# Altium schematic sheet QTouch2.SchDoc
size A4
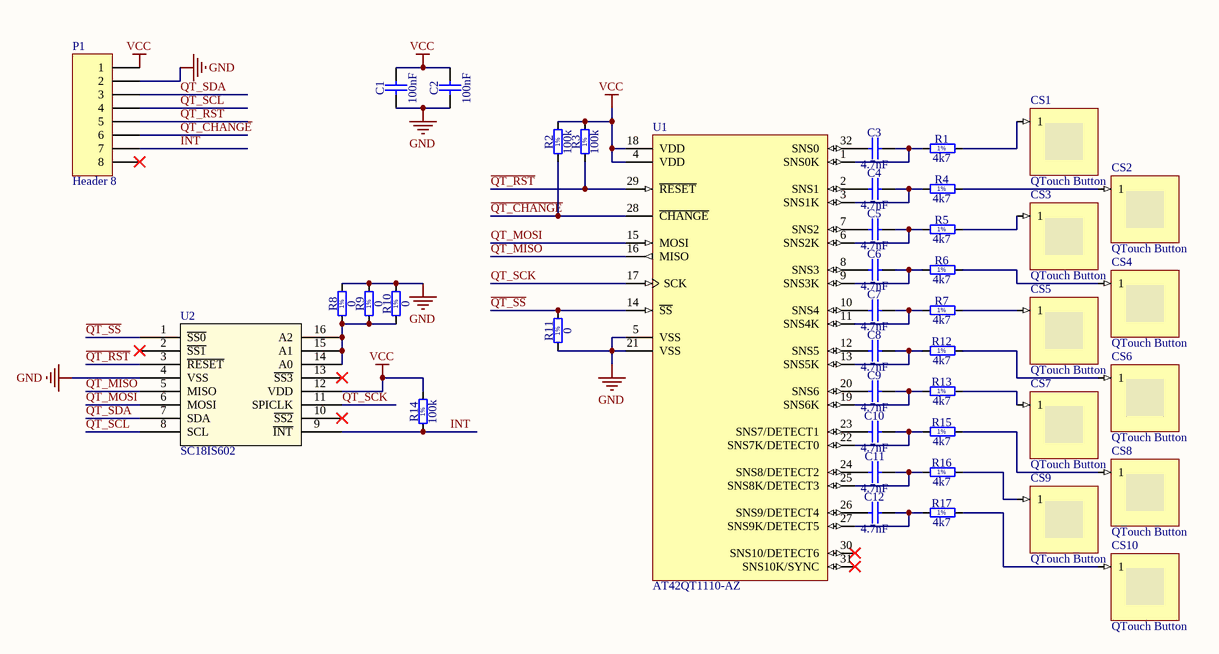
[diagram p0: QTouch2.SchDoc]

## Parts
C1  100nF  [CAPC1005X55N]
C2  100nF  [CAPC1005X55N]
C3  4.7nF  [CAPC1608X87N]
C4  4.7nF  [CAPC1608X87N]
C5  4.7nF  [CAPC1608X87N]
C6  4.7nF  [CAPC1608X87N]
C7  4.7nF  [CAPC1608X87N]
C8  4.7nF  [CAPC1608X87N]
C9  4.7nF  [CAPC1608X87N]
C10  4.7nF  [CAPC1608X87N]
C11  4.7nF  [CAPC1608X87N]
C12  4.7nF  [CAPC1608X87N]
CS1  QTouch Button  (no BOM)
CS2  QTouch Button  (no BOM)
CS3  QTouch Button  (no BOM)
CS4  QTouch Button  (no BOM)
CS5  QTouch Button  (no BOM)
CS6  QTouch Button  (no BOM)
CS7  QTouch Button  (no BOM)
CS8  QTouch Button  (no BOM)
CS9  QTouch Button  (no BOM)
CS10  QTouch Button  (no BOM)
P1  Header 8  [Header 2x4 SMD]
R1  4k7  [RESC1608X55N]
R2  100k  [RESC1005X40N]
R3  100k  [RESC1005X40N]
R4  4k7  [RESC1608X55N]
R5  4k7  [RESC1608X55N]
R6  4k7  [RESC1608X55N]
R7  4k7  [RESC1608X55N]
R8  0  [RESC1608X55N]
R9  0  [RESC1608X55N]
R10  0  [RESC1608X55N]
R11  0  [RESC1608X55N]
R12  4k7  [RESC1608X55N]
R13  4k7  [RESC1608X55N]
R14  100k  [RESC1005X40N]
R15  4k7  [RESC1608X55N]
R16  4k7  [RESC1608X55N]
R17  4k7  [RESC1608X55N]
U1  AT42QT1110-AZ  [32A_N]
U2  SC18IS602  [TSSOP-16]

## Nets
GND: C1.1 C2.1 P1.2 R8.2 R9.2 R10.2 R11.1 U1.5(VSS) U1.21(VSS) U2.4(VSS)
VCC: C1.2 C2.2 P1.1 R2.2 R3.2 R14.2 U1.4(VDD) U1.18(VDD) U2.12(VDD)
~{QT_CHANGE}: P1.6 R2.1 U1.28(~{CHANGE})
INT: P1.7 R14.1 U2.9(~{INT})
~{QT_RST}: P1.5 R3.1 U1.29(~{RESET}) U2.3(~{RESET})
~{QT_SS}: R11.2 U1.14(~{SS}) U2.1(~{SS0})
QT_MISO: U1.16(MISO) U2.5(MISO)
QT_MOSI: U1.15(MOSI) U2.6(MOSI)
QT_SCK: U1.17(SCK) U2.11(SPICLK)
QT_SCL: P1.4 U2.8(SCL)
QT_SDA: P1.3 U2.7(SDA)
NetC3_1: C3.1 U1.32(SNS0)
NetC3_2: C3.2 R1.1 U1.1(SNS0K)
NetC4_1: C4.1 U1.2(SNS1)
NetC4_2: C4.2 R4.1 U1.3(SNS1K)
NetC5_1: C5.1 U1.7(SNS2)
NetC5_2: C5.2 R5.1 U1.6(SNS2K)
NetC6_1: C6.1 U1.8(SNS3)
NetC6_2: C6.2 R6.1 U1.9(SNS3K)
NetC7_1: C7.1 U1.10(SNS4)
NetC7_2: C7.2 R7.1 U1.11(SNS4K)
NetC8_1: C8.1 U1.12(SNS5)
NetC8_2: C8.2 R12.1 U1.13(SNS5K)
NetC9_1: C9.1 U1.20(SNS6)
NetC9_2: C9.2 R13.1 U1.19(SNS6K)
NetC10_1: C10.1 U1.23(SNS7/DETECT1)
NetC10_2: C10.2 R15.1 U1.22(SNS7K/DETECT0)
NetC11_1: C11.1 U1.24(SNS8/DETECT2)
NetC11_2: C11.2 R16.1 U1.25(SNS8K/DETECT3)
NetC12_1: C12.1 U1.26(SNS9/DETECT4)
NetC12_2: C12.2 R17.1 U1.27(SNS9K/DETECT5)
NetCS1_1: CS1.1 R1.2
NetCS2_1: CS2.1 R4.2
NetCS3_1: CS3.1 R5.2
NetCS4_1: CS4.1 R6.2
NetCS5_1: CS5.1 R7.2
NetCS6_1: CS6.1 R12.2
NetCS7_1: CS7.1 R13.2
NetCS8_1: CS8.1 R15.2
NetCS9_1: CS9.1 R16.2
NetCS10_1: CS10.1 R17.2
NetR8_1: R8.1 R9.1 R10.1 U2.14(A0) U2.15(A1) U2.16(A2)

Not connected (* = marked no-connect by the designer): P1 8*; U1 30(SNS10/DETECT6)* 31(SNS10K/SYNC)*; U2 2(~{SS1})* 10(~{SS2})* 13(~{SS3})*

## Notes on the sheet
- (in symbol R0402_100K_1%_0.0625W_100PPM) 1%
- (in symbol R0603_0R_JUMPER) 1%
- (in symbol R0603_4K7_1%_0.1W_100PPM) 1%

## Library data of the parts
C1 C2 = CC0402_100NF_16V_10%_X7R: Non-polarised capacitor; Part Description: SMD Multilayer Chip Ceramic Capacitor; Manufacturer: GENERIC; Manufacturer1 Part Number: 223878715649; Voltage: 16V; TC: X7R; Tolerance: ±10%; Table: Capacitors SMD; Part Number: CC0402_100NF_16V_10%_X7R; Component Kind: Standard; Component Type: Standard; Pin Count: 2; Value: 100nF; Status: Not Recommended; Manufacturer Part Number: CC0402_100NF_16V_10%_X7R; Case: 0402; Mounted: Yes; Socket: No; SMD: Yes; Manufacturer1 Example: PHYCOMP; Manufacturer1 ComponentHeight: 0.55mm; HelpURL: \\cern.ch\dfs\Applications\Altium\Datasheets\CC0402_X7R_PHYCOMP.pdf; Author: CERN DEM JLC; CreateDate: 2007-12-03; LatestRevisionDate: 2007-12-03
C3-C12 = CC0603_4.7NF_50V_10%_X7R: Non-polarised capacitor; Part Description: SMD Multilayer Chip Ceramic Capacitor; Manufacturer: GENERIC; Manufacturer1 Part Number: 223858615632; Voltage: 50V; TC: X7R; Tolerance: ±10%; Table: Capacitors SMD; Part Number: CC0603_4.7NF_50V_10%_X7R; Component Kind: Standard; Component Type: Standard; Pin Count: 2; Value: 4.7nF; Status: Preferred; Manufacturer Part Number: CC0603_4.7NF_50V_10%_X7R; Case: 0603; Mounted: Yes; Socket: No; SMD: Yes; Manufacturer1 Example: PHYCOMP; Manufacturer1 ComponentHeight: 0.87mm; HelpURL: \\cern.ch\dfs\Applications\Altium\Datasheets\CC0603_X7R_PHYCOMP.pdf; Author: CERN DEM JLC; CreateDate: 2007-12-03; LatestRevisionDate: 2007-12-03
CS1 = QTouchButton: ConfiguratorName: ATMEL_TOUCH; ConfigurationParameters: {}__sensorid[1]{}width[6]{}height[6]{}
CS2-CS10 = QTouchButton: ConfiguratorName: ATMEL_TOUCH; ConfigurationParameters: {}__sensorid[1]{}width[10]{}height[10]{}
P1 = Header 8: Header, 8-Pin; LatestRevisionDate: 17-Jul-2002; LatestRevisionNote: Re-released for DXP Platform.; Publisher: Altium Limited
R1 R4-R7 R12 R13 R15-R17 = R0603_4K7_1%_0.1W_100PPM: Resistor - 1%; Part Description: General Purpose Thick Film Chip Resistor; Manufacturer: GENERIC; Manufacturer1 Part Number: NRC06F4701TRF; Power: 0.1W; TC: ±100ppm/°C; Table: Resistors SMD; Part Number: R0603_4K7_1%_0.1W_100PPM; Component Kind: Standard; Component Type: Standard; Pin Count: 2; Value: 4k7; Status: Preferred; Tolerance: ±1%; Manufacturer Part Number: R0603_4K7_1%_0.1W_100PPM; Case: 0603; Mounted: Yes; Socket: No; SMD: Yes; Manufacturer1 Example: NIC COMPONENT; Manufacturer1 ComponentHeight: 0.55mm; HelpURL: \\cern.ch\dfs\Applications\Altium\Datasheets\R0603_NIC_NRC.pdf; Author: CERN DEM JLC; CreateDate: 2007-12-03; LatestRevisionDate: 2008-03-13
R2 R3 R14 = R0402_100K_1%_0.0625W_100PPM: Resistor - 1%; Part Description: General Purpose Thick Film Chip Resistor; Manufacturer: GENERIC; Manufacturer1 Part Number: 232270671004; TC: ±100ppm/°C; Table: Resistors SMD; Part Number: R0402_100K_1%_0.0625W_100PPM; Component Kind: Standard; Component Type: Standard; Pin Count: 2; Value: 100k; Status: Not recommended; Power: 0.0625W; Tolerance: ±1%; Manufacturer Part Number: R0402_100K_1%_0.0625W_100PPM; Case: 0402; Mounted: Yes; Socket: No; SMD: Yes; Manufacturer1 Example: PHYCOMP; Manufacturer1 ComponentHeight: 0.4mm; HelpURL: \\cern.ch\dfs\Applications\Altium\Datasheets\R0402_Phycomp_RC0402.pdf; Author: CERN DEM JLC; CreateDate: 2007-12-03; LatestRevisionDate: 2008-03-13
R8-R11 = R0603_0R_JUMPER: Resistor - 1%; Part Description: 1A (0.05R Max DC Resistance) Zero Ohm Jumper; Manufacturer: GENERIC; Manufacturer1 Part Number: NRC06Z0; Table: Resistors SMD; Part Number: R0603_0R_JUMPER; Component Kind: Standard; Component Type: Standard; Pin Count: 2; Value: 0; Status: Preferred; Manufacturer Part Number: R0603_0R_JUMPER; Case: 0603; Mounted: Yes; Socket: No; SMD: Yes; Manufacturer1 Example: NIC COMPONENT; Manufacturer1 ComponentHeight: 0.55mm; HelpURL: \\cern.ch\dfs\Applications\Altium\Datasheets\R0603_NIC_NRC.pdf; Author: CERN DEM JLC; CreateDate: 2007-12-03; LatestRevisionDate: 2008-03-13
U1 = AT42QT1110-AZ: QTouch 11-key Sensor IC, 32-Pin TQFP; Published: 1-Apr-2010; DatasheetVersion: revH, Feb-2010; PackageVersion: revB, Oct-2001; PackageReference: 32A; Publisher: Altium Limited; PackageDescription: 32-Lead, 7x7x1.0 mm Body, 0.8mm Lead Pitch, Thin Profile Plastic Quad Flat Package (TQFP); Supplier 1: Digi-Key; Supplier Part Number 1: AT42QT1110-AZ-ND; Supplier 2: Mouser; Supplier Part Number 2: 556-AT42QT1110-AZ; Code_JEDEC: MS-026-ABA; ComponentLink1Description: Manufacturer Link; ComponentLink1URL: http://www.atmel.com/products/overview_touch.asp?; ComponentLink2Description: AT42QT1110 Datasheet; ComponentLink2URL: http://www.atmel.com/dyn/resources/prod_documents/doc9570.pdf; ComponentLink3Description: Atmel.com Home; ComponentLink3URL: http://www.atmel.com
U2 = SC18IS602: I2C TO SPI NXP BRIDGE